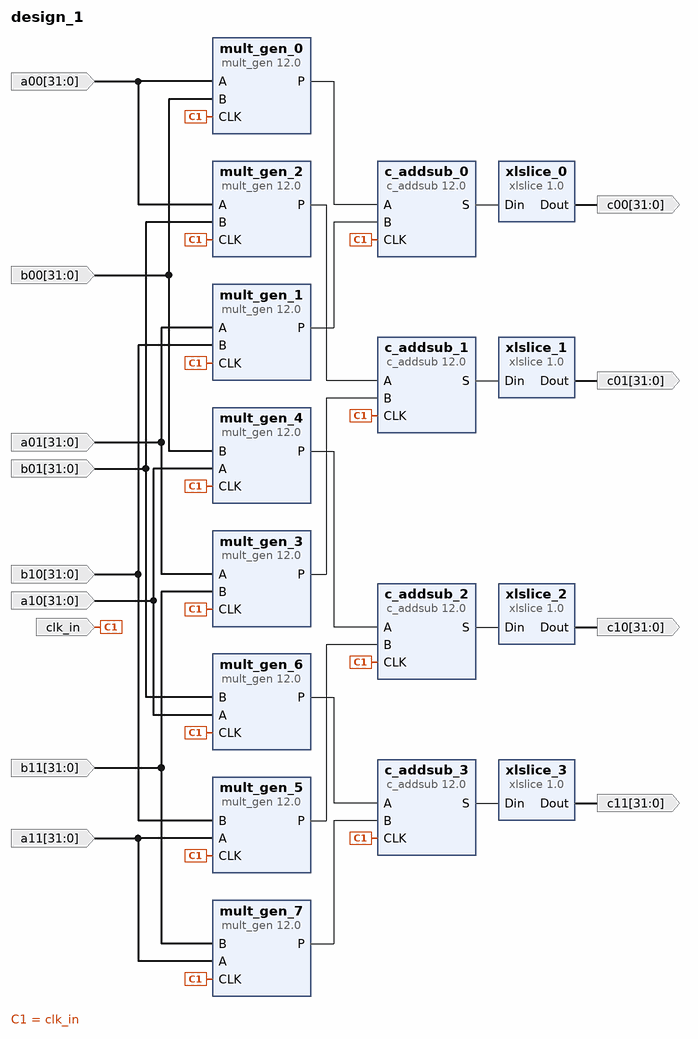
[diagram p0: block diagram of the top level]
# Vivado block design design_1, xc7a35tcpg236-1, Vivado 2019.2
create_bd_design design_1

create_bd_port -dir O -from 31 -to 0 c00
create_bd_port -dir O -from 31 -to 0 c01
create_bd_port -dir O -from 31 -to 0 c10
create_bd_port -dir O -from 31 -to 0 c11
create_bd_port -dir I -type clk clk_in
set_property -dict {CONFIG.FREQ_HZ 100000000} [get_bd_ports clk_in]
create_bd_port -dir I -from 31 -to 0 -type data a00
create_bd_port -dir I -from 31 -to 0 -type data a01
create_bd_port -dir I -from 31 -to 0 -type data a10
create_bd_port -dir I -from 31 -to 0 -type data a11
create_bd_port -dir I -from 31 -to 0 -type data b00
create_bd_port -dir I -from 31 -to 0 -type data b01
create_bd_port -dir I -from 31 -to 0 -type data b10
create_bd_port -dir I -from 31 -to 0 -type data b11

create_bd_cell -type ip -vlnv xilinx.com:ip:mult_gen:12.0 mult_gen_0
set_property -dict {CONFIG.PipeStages 5 CONFIG.PortAWidth 32 CONFIG.PortBWidth 32} [get_bd_cells mult_gen_0]
create_bd_cell -type ip -vlnv xilinx.com:ip:mult_gen:12.0 mult_gen_1
set_property -dict {CONFIG.PipeStages 5 CONFIG.PortAWidth 32 CONFIG.PortBWidth 32} [get_bd_cells mult_gen_1]
create_bd_cell -type ip -vlnv xilinx.com:ip:mult_gen:12.0 mult_gen_2
set_property -dict {CONFIG.PipeStages 5 CONFIG.PortAWidth 32 CONFIG.PortBWidth 32} [get_bd_cells mult_gen_2]
create_bd_cell -type ip -vlnv xilinx.com:ip:mult_gen:12.0 mult_gen_3
set_property -dict {CONFIG.PipeStages 5 CONFIG.PortAWidth 32 CONFIG.PortBWidth 32} [get_bd_cells mult_gen_3]
create_bd_cell -type ip -vlnv xilinx.com:ip:mult_gen:12.0 mult_gen_4
set_property -dict {CONFIG.PipeStages 5 CONFIG.PortAWidth 32 CONFIG.PortBWidth 32} [get_bd_cells mult_gen_4]
create_bd_cell -type ip -vlnv xilinx.com:ip:mult_gen:12.0 mult_gen_5
set_property -dict {CONFIG.PipeStages 5 CONFIG.PortAWidth 32 CONFIG.PortBWidth 32} [get_bd_cells mult_gen_5]
create_bd_cell -type ip -vlnv xilinx.com:ip:mult_gen:12.0 mult_gen_6
set_property -dict {CONFIG.PipeStages 5 CONFIG.PortAWidth 32 CONFIG.PortBWidth 32} [get_bd_cells mult_gen_6]
create_bd_cell -type ip -vlnv xilinx.com:ip:mult_gen:12.0 mult_gen_7
set_property -dict {CONFIG.PipeStages 5 CONFIG.PortAWidth 32 CONFIG.PortBWidth 32} [get_bd_cells mult_gen_7]
create_bd_cell -type ip -vlnv xilinx.com:ip:c_addsub:12.0 c_addsub_0
set_property -dict [list \
  CONFIG.A_Width 64 \
  CONFIG.B_Value 0000000000000000000000000000000000000000000000000000000000000000 \
  CONFIG.B_Width 64 \
  CONFIG.Latency 2 \
  CONFIG.Out_Width 65 \
] [get_bd_cells c_addsub_0]
create_bd_cell -type ip -vlnv xilinx.com:ip:c_addsub:12.0 c_addsub_1
set_property -dict [list \
  CONFIG.A_Width 64 \
  CONFIG.B_Value 0000000000000000000000000000000000000000000000000000000000000000 \
  CONFIG.B_Width 64 \
  CONFIG.Latency 2 \
  CONFIG.Out_Width 65 \
] [get_bd_cells c_addsub_1]
create_bd_cell -type ip -vlnv xilinx.com:ip:c_addsub:12.0 c_addsub_2
set_property -dict [list \
  CONFIG.A_Width 64 \
  CONFIG.B_Value 0000000000000000000000000000000000000000000000000000000000000000 \
  CONFIG.B_Width 64 \
  CONFIG.Latency 2 \
  CONFIG.Out_Width 65 \
] [get_bd_cells c_addsub_2]
create_bd_cell -type ip -vlnv xilinx.com:ip:c_addsub:12.0 c_addsub_3
set_property -dict [list \
  CONFIG.A_Width 64 \
  CONFIG.B_Value 0000000000000000000000000000000000000000000000000000000000000000 \
  CONFIG.B_Width 64 \
  CONFIG.Latency 2 \
  CONFIG.Out_Width 65 \
] [get_bd_cells c_addsub_3]
create_bd_cell -type ip -vlnv xilinx.com:ip:xlslice:1.0 xlslice_0
set_property -dict {CONFIG.DIN_FROM 31 CONFIG.DIN_TO 0 CONFIG.DIN_WIDTH 65 CONFIG.DOUT_WIDTH 32} [get_bd_cells xlslice_0]
create_bd_cell -type ip -vlnv xilinx.com:ip:xlslice:1.0 xlslice_1
set_property -dict {CONFIG.DIN_FROM 31 CONFIG.DIN_TO 0 CONFIG.DIN_WIDTH 65 CONFIG.DOUT_WIDTH 32} [get_bd_cells xlslice_1]
create_bd_cell -type ip -vlnv xilinx.com:ip:xlslice:1.0 xlslice_2
set_property -dict {CONFIG.DIN_FROM 31 CONFIG.DIN_TO 0 CONFIG.DIN_WIDTH 65 CONFIG.DOUT_WIDTH 32} [get_bd_cells xlslice_2]
create_bd_cell -type ip -vlnv xilinx.com:ip:xlslice:1.0 xlslice_3
set_property -dict {CONFIG.DIN_FROM 31 CONFIG.DIN_TO 0 CONFIG.DIN_WIDTH 65 CONFIG.DOUT_WIDTH 32} [get_bd_cells xlslice_3]

# ---- connections ----

connect_bd_net -net a00_1 [get_bd_ports a00] [get_bd_pins mult_gen_0/A] [get_bd_pins mult_gen_2/A]
connect_bd_net -net b00_1 [get_bd_ports b00] [get_bd_pins mult_gen_0/B] [get_bd_pins mult_gen_4/B]
connect_bd_net -net b10_1 [get_bd_ports b10] [get_bd_pins mult_gen_1/B] [get_bd_pins mult_gen_5/B]
connect_bd_net -net b01_1 [get_bd_ports b01] [get_bd_pins mult_gen_2/B] [get_bd_pins mult_gen_6/B]
connect_bd_net -net b11_1 [get_bd_ports b11] [get_bd_pins mult_gen_3/B] [get_bd_pins mult_gen_7/B]
connect_bd_net -net a10_1 [get_bd_ports a10] [get_bd_pins mult_gen_4/A] [get_bd_pins mult_gen_6/A]
connect_bd_net -net a11_1 [get_bd_ports a11] [get_bd_pins mult_gen_5/A] [get_bd_pins mult_gen_7/A]
connect_bd_net [get_bd_pins mult_gen_0/P] [get_bd_pins c_addsub_0/A]
connect_bd_net [get_bd_pins mult_gen_1/P] [get_bd_pins c_addsub_0/B]
connect_bd_net [get_bd_pins mult_gen_2/P] [get_bd_pins c_addsub_1/A]
connect_bd_net [get_bd_pins mult_gen_3/P] [get_bd_pins c_addsub_1/B]
connect_bd_net [get_bd_pins mult_gen_4/P] [get_bd_pins c_addsub_2/A]
connect_bd_net [get_bd_pins mult_gen_5/P] [get_bd_pins c_addsub_2/B]
connect_bd_net [get_bd_pins mult_gen_6/P] [get_bd_pins c_addsub_3/A]
connect_bd_net [get_bd_pins mult_gen_7/P] [get_bd_pins c_addsub_3/B]
connect_bd_net [get_bd_pins c_addsub_0/S] [get_bd_pins xlslice_0/Din]
connect_bd_net [get_bd_pins c_addsub_1/S] [get_bd_pins xlslice_1/Din]
connect_bd_net [get_bd_pins c_addsub_2/S] [get_bd_pins xlslice_2/Din]
connect_bd_net [get_bd_pins c_addsub_3/S] [get_bd_pins xlslice_3/Din]
connect_bd_net [get_bd_pins xlslice_0/Dout] [get_bd_ports c00]
connect_bd_net [get_bd_pins xlslice_1/Dout] [get_bd_ports c01]
connect_bd_net [get_bd_pins xlslice_2/Dout] [get_bd_ports c10]
connect_bd_net [get_bd_pins xlslice_3/Dout] [get_bd_ports c11]
connect_bd_net [get_bd_ports clk_in] \
  [get_bd_pins mult_gen_0/CLK] [get_bd_pins mult_gen_1/CLK] [get_bd_pins mult_gen_2/CLK] [get_bd_pins c_addsub_0/CLK] \
  [get_bd_pins c_addsub_1/CLK] [get_bd_pins c_addsub_2/CLK] [get_bd_pins mult_gen_3/CLK] [get_bd_pins mult_gen_7/CLK] \
  [get_bd_pins c_addsub_3/CLK] [get_bd_pins mult_gen_6/CLK] [get_bd_pins mult_gen_4/CLK] [get_bd_pins mult_gen_5/CLK]
connect_bd_net -net a01_1 [get_bd_ports a01] [get_bd_pins mult_gen_1/A] [get_bd_pins mult_gen_3/A]

validate_bd_design
save_bd_design
